# EAGLE schematic Food Contamination Detector - Display Module (EAGLE 8.6.2)

## Sheet 1 of 2
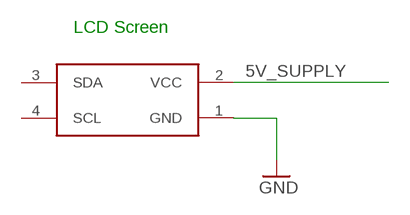
[diagram p0: schematic, sheet 1]

### Parts
U$1  LCDSCREEN  [LCDSCREEN]
Unconnected: U$1.1(GND) U$1.2(VCC) U$1.3(SDA) U$1.4(SCL)

### Notes on the sheet
- LCD Screen

## Sheet 2 of 2
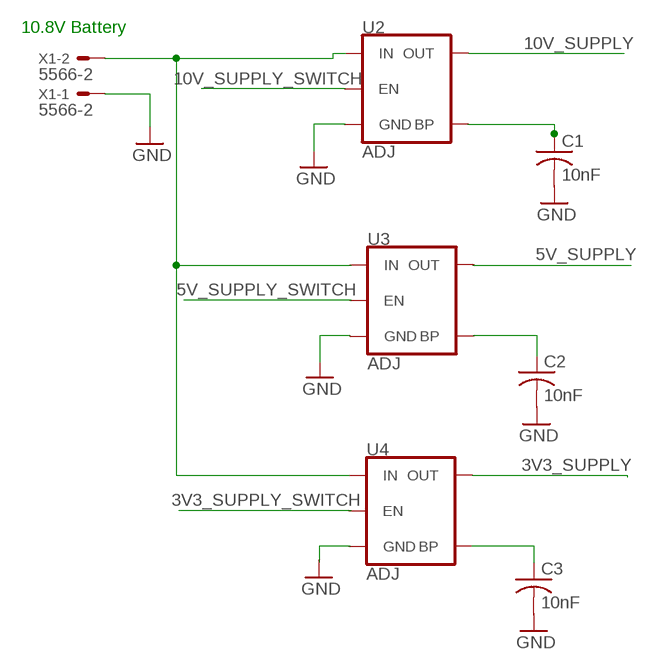
[diagram p1: schematic, sheet 2]

### Parts
C1  10nF  C-US025-025X050  [C025-025X050]
C2  10nF  C-US025-025X050  [C025-025X050]
C3  10nF  C-US025-025X050  [C025-025X050]
U2  ADJ  V_REG_MIC5205ADJ  [SOT23-5]
U3  ADJ  V_REG_MIC5205ADJ  [SOT23-5]
U4  ADJ  V_REG_MIC5205ADJ  [SOT23-5]
X1  5566-2  [5566-2]

### Nets
N$18: C1.1
Unconnected: C1.2 C2.1 C2.2 C3.1 C3.2 U2.1(IN) U2.2(GND) U2.3(EN) U2.4(BP) U2.5(OUT) U3.1(IN) U3.2(GND) U3.3(EN) U3.4(BP) U3.5(OUT) U4.1(IN) U4.2(GND) U4.3(EN) U4.4(BP) U4.5(OUT) X1.1 X1.2

### Notes on the sheet
- 10.8V Battery

## Library data of the parts
C1-C3 = rcl:C-US: CAPACITOR, American symbol; SPICEPREFIX: C
U2-U4 = SparkFun-IC-Power:V_REG_MIC5205: V_REG MIC5205 Standard 3.3V, 5V, and Adjustable 150mA LDO voltage regulator in SOT-23 layout. Micrel part MIC5205. BP (by-pass) pin is used to lower output noise with 470pF cap, may be left open. On the adjustable version BP is used to set output.; PROD_ID: VREG-12594
U$1 = TGS822:LCDSCREEN
X1 = con-molex:5566-2: Mini FIT connector 2 pol Source: http://www.molex.com; MF: MOLEX; OC_FARNELL: 1822072; OC_NEWARK: unknown